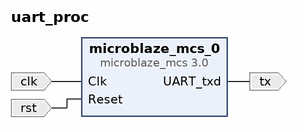
[diagram p0: block diagram of the top level]
# Vivado block design uart_proc, xc7a35ticsg324-1L, Vivado 2023.1
create_bd_design uart_proc

create_bd_port -dir I -type clk clk
set_property -dict {CONFIG.FREQ_HZ 100000000} [get_bd_ports clk]
create_bd_port -dir I -type rst rst
create_bd_port -dir O tx

create_bd_cell -type ip -vlnv xilinx.com:ip:microblaze_mcs:3.0 microblaze_mcs_0
set_property -dict {CONFIG.UART_BAUDRATE 115200 CONFIG.USE_UART_TX 1} [get_bd_cells microblaze_mcs_0]

# ---- connections ----

connect_bd_net [get_bd_ports clk] [get_bd_pins microblaze_mcs_0/Clk]
connect_bd_net [get_bd_pins microblaze_mcs_0/UART_txd] [get_bd_ports tx]
connect_bd_net [get_bd_ports rst] [get_bd_pins microblaze_mcs_0/Reset]

validate_bd_design
save_bd_design
